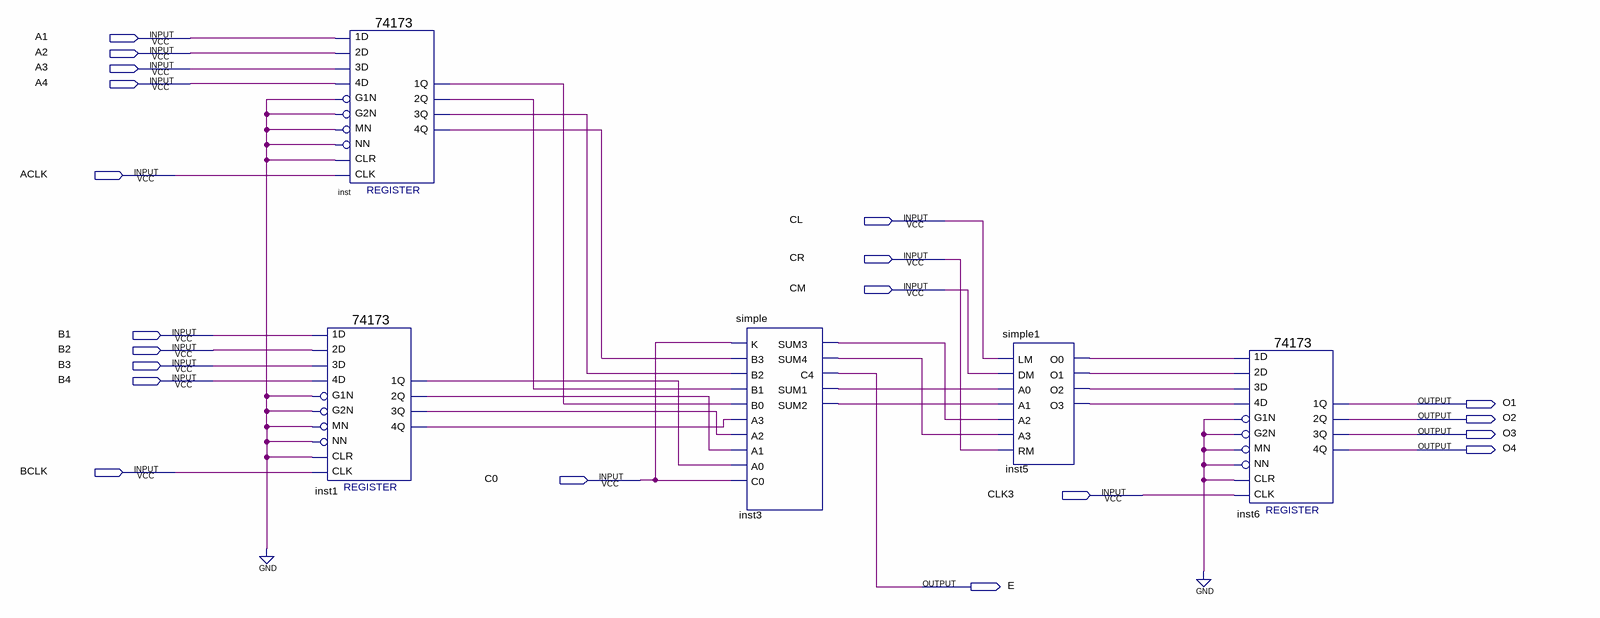
[diagram p0: schematic sheet]
// Quartus schematic exp5.bdf as structural Verilog: 5 symbols, 20 pins
module exp5 (
  input  A1,
  input  A2,
  input  A3,
  input  A4,
  input  ACLK,
  input  CL,
  input  CR,
  input  CM,
  input  B1,
  input  B2,
  input  B3,
  input  B4,
  input  BCLK,
  input  C0,
  input  CLK3,
  output O1,
  output O2,
  output O3,
  output O4,
  output E
);

  wire inst1_1q, inst1_2q, inst1_3q, inst1_4q, inst3_sum1, inst3_sum2, inst3_sum3, inst3_sum4, inst5_o0,
       inst5_o1, inst5_o2, inst5_o3, inst_1q, inst_2q, inst_3q, inst_4q;

  \74173  inst1 (
    .\3D (B3), .MN(1'b0), .\1D (B1), .\2D (B2), .\4D (B4), .G1N(1'b0), .G2N(1'b0), .NN(1'b0), .CLR(1'b0),
    .CLK(BCLK), .\3Q (inst1_3q), .\2Q (inst1_2q), .\1Q (inst1_1q), .\4Q (inst1_4q));
  \74173  inst (
    .\3D (A3), .MN(1'b0), .\1D (A1), .\2D (A2), .\4D (A4), .G1N(1'b0), .G2N(1'b0), .NN(1'b0), .CLR(1'b0),
    .CLK(ACLK), .\3Q (inst_3q), .\2Q (inst_2q), .\1Q (inst_1q), .\4Q (inst_4q));
  simple inst3 (
    .K(C0), .B3(inst_4q), .B2(inst_3q), .B1(inst_2q), .B0(inst_1q), .A3(inst1_4q), .A2(inst1_3q),
    .A1(inst1_2q), .A0(inst1_1q), .C0(C0), .SUM3(inst3_sum3), .SUM4(inst3_sum4), .C4(E), .SUM1(inst3_sum1),
    .SUM2(inst3_sum2));
  simple1 inst5 (
    .LM(CL), .DM(CM), .A0(inst3_sum1), .A1(inst3_sum2), .A2(inst3_sum3), .A3(inst3_sum4), .RM(CR),
    .O0(inst5_o0), .O1(inst5_o1), .O2(inst5_o2), .O3(inst5_o3));
  \74173  inst6 (
    .\3D (inst5_o2), .MN(1'b0), .\1D (inst5_o0), .\2D (inst5_o1), .\4D (inst5_o3), .G1N(1'b0), .G2N(1'b0),
    .NN(1'b0), .CLR(1'b0), .CLK(CLK3), .\3Q (O3), .\2Q (O2), .\1Q (O1), .\4Q (O4));
endmodule
